# EAGLE schematic adapter1 (EAGLE 6.4)
DATABASE: ./../../dossant-PARTSDB.txt
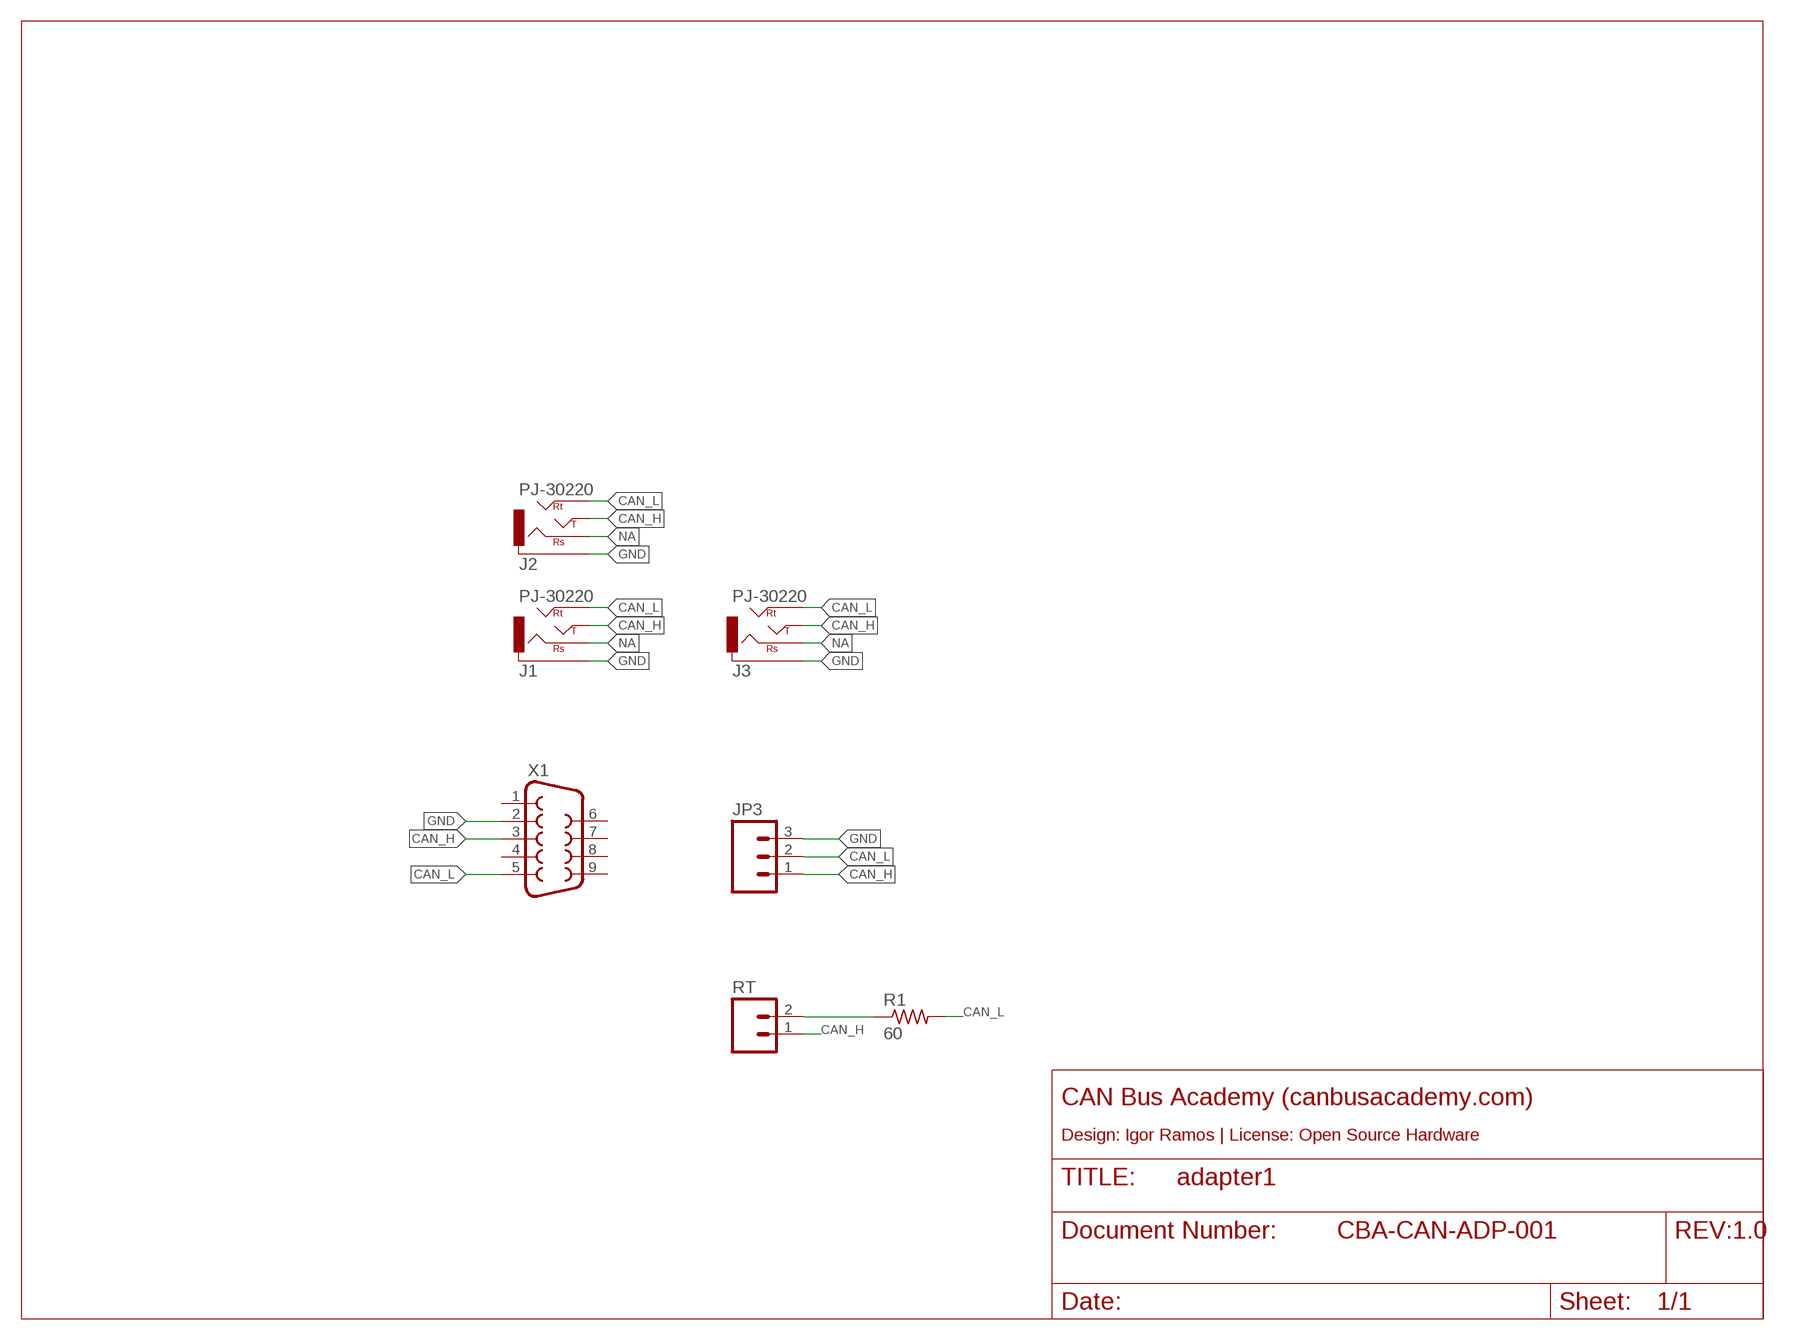
[diagram p0: schematic, sheet 1]

## Parts
J1  PJ-30220  AUDIO_JACK_4POSA  [PJ-30220]
J2  PJ-30220  AUDIO_JACK_4POSA  [PJ-30220]
J3  PJ-30220  AUDIO_JACK_4POSA  [PJ-30220]
JP3  M03PTH  [1X03]
R1  60  R-US_M0805  [M0805]
RT  M02PTH  [1X02]
X1  DB9FEMALE  [DB9]

## Nets
CAN_H: J1.P$03(TIP) J1.P$03B(TIP) J2.P$03(TIP) J2.P$03B(TIP) J3.P$03(TIP) J3.P$03B(TIP) JP3.1 RT.1 X1.3
CAN_L: J1.P$04(RT) J2.P$04(RT) J3.P$04(RT) JP3.2 R1.2 X1.5
GND: J1.P$01(SLEEVE) J2.P$01(SLEEVE) J3.P$01(SLEEVE) JP3.3 X1.2
N$4: R1.1 RT.2
NA: J1.P$02(RS) J2.P$02(RS) J3.P$02(RS)
Unconnected: X1.1 X1.4 X1.6 X1.7 X1.8 X1.9

## Notes on the sheet
- CAN Bus Academy (canbusacademy.com)
- Design: Igor Ramos | License: Open Source Hardware
- CBA-CAN-ADP-001 | 1.0

## Library data of the parts
J1-J3 = igor_lib_6d4d0:AUDIO_JACK_4POS: updated as of 5/4/2013. v1: initial v2: swapped tip and rt based on bad cable, reduced hole diam. v3: swapped RS and RT and added tName pinout; PARTNO: PJ30220
JP3 = SparkFun:M03: Header 3 Standard 3-pin 0.1" header. Use with straight break away headers (SKU : PRT-00116), right angle break away headers (PRT-00553), swiss pins (PRT-00743), machine pins (PRT-00117), and female headers (PRT-00115). Molex polarized connector foot print use with SKU : PRT-08232 with associated crimp pins and housings.
R1 = rcl:R-US_: RESISTOR, American symbol
RT = SparkFun:M02: Header 2 Standard 2-pin 0.1" header. Use with straight break away headers (SKU : PRT-00116), right angle break away headers (PRT-00553), swiss pins (PRT-00743), machine pins (PRT-00117), and female headers (PRT-00115). Molex polarized connector foot print use with SKU : PRT-08233 with associated crimp pins and housings.
X1 = SparkFun:DB9: DB9 Connector Standard DB9 (D-Sub 9) serial connector. Can be used for CAN bus as well as RS485 and RS232. Footprint production proven. Spark Fun Electronics SKU : PRT-00429